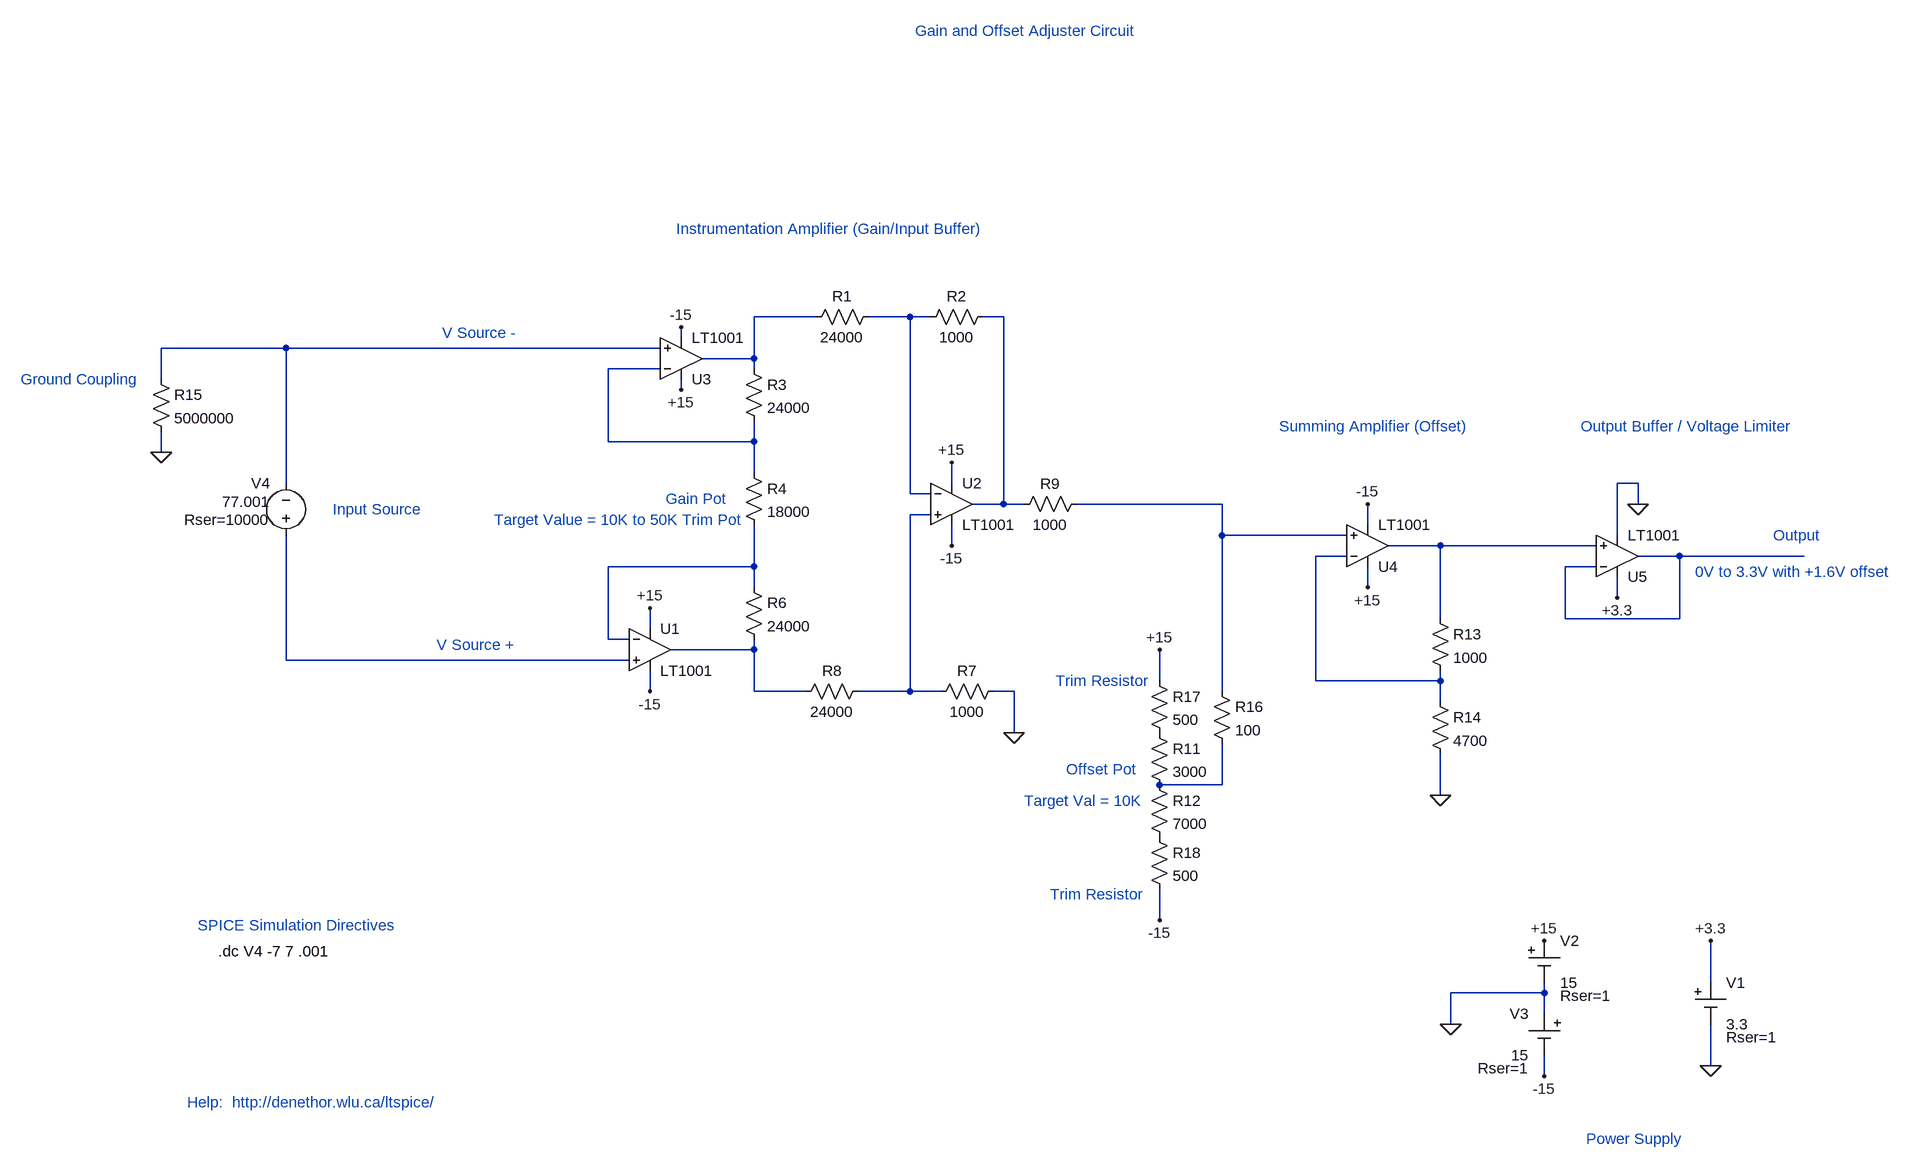
[diagram p0: schematic AnalogScaler_SimulationLTSPICE.asc]
AnalogScaler_SimulationLTSPICE.asc, the LTspice schematic file:
Version 4
SHEET 1 1356 1016
WIRE -384 -352 -480 -352
WIRE -240 -352 -304 -352
WIRE -208 -352 -240 -352
WIRE -96 -352 -128 -352
WIRE -592 -320 -592 -336
WIRE -1200 -304 -1392 -304
WIRE -624 -304 -1200 -304
WIRE -480 -288 -480 -352
WIRE -480 -288 -560 -288
WIRE -624 -272 -704 -272
WIRE -480 -272 -480 -288
WIRE -1392 -256 -1392 -304
WIRE -592 -240 -592 -256
WIRE -704 -160 -704 -272
WIRE -480 -160 -480 -192
WIRE -480 -160 -704 -160
WIRE -1392 -144 -1392 -176
WIRE -480 -112 -480 -160
WIRE -1200 -96 -1200 -304
WIRE -176 -96 -176 -128
WIRE 880 -96 848 -96
WIRE -240 -80 -240 -352
WIRE -208 -80 -240 -80
WIRE -96 -64 -96 -352
WIRE -96 -64 -144 -64
WIRE -64 -64 -96 -64
WIRE 240 -64 16 -64
WIRE 880 -64 880 -96
WIRE -208 -48 -240 -48
WIRE 464 -32 464 -64
WIRE 240 -16 240 -64
WIRE 432 -16 240 -16
WIRE 848 -16 848 -96
WIRE -176 0 -176 -32
WIRE 576 0 496 0
WIRE 816 0 576 0
WIRE 432 16 384 16
WIRE 944 16 880 16
WIRE 1136 16 944 16
WIRE -480 32 -480 -32
WIRE -480 32 -704 32
WIRE 816 32 768 32
WIRE -480 64 -480 32
WIRE 464 64 464 32
WIRE 848 80 848 48
WIRE 576 112 576 0
WIRE 768 112 768 32
WIRE 944 112 944 16
WIRE 944 112 768 112
WIRE -640 128 -640 96
WIRE -704 144 -704 32
WIRE -672 144 -704 144
WIRE -480 160 -480 144
WIRE -480 160 -608 160
WIRE -1200 176 -1200 -16
WIRE -672 176 -1200 176
WIRE 144 208 144 160
WIRE 384 208 384 16
WIRE 576 208 576 192
WIRE 576 208 384 208
WIRE -640 224 -640 192
WIRE -480 224 -480 160
WIRE -400 224 -480 224
WIRE -240 224 -240 -48
WIRE -240 224 -320 224
WIRE -192 224 -240 224
WIRE -80 224 -112 224
WIRE 240 224 240 -16
WIRE 576 240 576 208
WIRE -80 288 -80 224
WIRE 240 368 240 304
WIRE 240 368 144 368
WIRE 576 384 576 320
WIRE 144 576 144 528
WIRE 992 672 992 608
WIRE 736 688 736 672
WIRE 736 688 592 688
WIRE 736 720 736 688
WIRE 592 736 592 688
WIRE 992 800 992 736
WIRE 736 816 736 784
FLAG 736 608 +15
FLAG 736 816 -15
FLAG 992 608 +3.3
FLAG 992 800 0
FLAG 592 736 0
FLAG -592 -240 +15
FLAG -592 -336 -15
FLAG -640 224 -15
FLAG -640 96 +15
FLAG -176 0 -15
FLAG 464 -64 -15
FLAG -176 -128 +15
FLAG 464 64 +15
FLAG 880 -64 0
FLAG 848 80 +3.3
FLAG -80 288 0
FLAG 144 160 +15
FLAG 144 576 -15
FLAG 576 384 0
FLAG -1392 -144 0
SYMBOL Opamps\\LT1001 -640 96 R0
SYMATTR InstName U1
SYMBOL Opamps\\LT1001 -176 -128 R0
SYMATTR InstName U2
SYMBOL Opamps\\LT1001 -592 -224 M180
SYMATTR InstName U3
SYMBOL Opamps\\LT1001 464 64 M180
SYMATTR InstName U4
SYMBOL Opamps\\LT1001 848 80 M180
SYMATTR InstName U5
SYMBOL Misc\\cell 992 672 R0
WINDOW 123 0 0 Left 2
WINDOW 39 24 84 Left 2
SYMATTR SpiceLine Rser=1
SYMATTR InstName V1
SYMATTR Value 3.3
SYMBOL Misc\\cell 736 608 R0
WINDOW 123 0 0 Left 2
WINDOW 39 24 84 Left 2
SYMATTR SpiceLine Rser=1
SYMATTR InstName V2
SYMATTR Value 15
SYMBOL Misc\\cell 736 720 M0
WINDOW 123 0 0 Left 2
WINDOW 39 24 84 Left 2
SYMATTR SpiceLine Rser=1
SYMATTR InstName V3
SYMATTR Value 15
SYMBOL res -288 -368 R90
WINDOW 0 0 56 VBottom 2
WINDOW 3 32 56 VTop 2
SYMATTR InstName R1
SYMATTR Value 24000
SYMBOL res -112 -368 R90
WINDOW 0 0 56 VBottom 2
WINDOW 3 32 56 VTop 2
SYMATTR InstName R2
SYMATTR Value 1000
SYMBOL res -496 -128 R0
SYMATTR InstName R4
SYMATTR Value 18000
SYMBOL res -496 48 R0
SYMATTR InstName R6
SYMATTR Value 24000
SYMBOL res -496 -288 R0
SYMATTR InstName R3
SYMATTR Value 24000
SYMBOL res -304 208 R90
WINDOW 0 0 56 VBottom 2
WINDOW 3 32 56 VTop 2
SYMATTR InstName R8
SYMATTR Value 24000
SYMBOL voltage -1200 0 R180
WINDOW 0 24 96 Left 2
WINDOW 3 24 68 Left 2
WINDOW 39 24 40 Left 2
WINDOW 123 0 0 Left 2
SYMATTR InstName V4
SYMATTR Value 77.001
SYMATTR SpiceLine Rser=10000
SYMBOL res -96 208 R90
WINDOW 0 0 56 VBottom 2
WINDOW 3 32 56 VTop 2
SYMATTR InstName R7
SYMATTR Value 1000
SYMBOL res 32 -80 R90
WINDOW 0 0 56 VBottom 2
WINDOW 3 32 56 VTop 2
SYMATTR InstName R9
SYMATTR Value 1000
SYMBOL res 128 272 R0
SYMATTR InstName R11
SYMATTR Value 3000
SYMBOL res 128 352 R0
SYMATTR InstName R12
SYMATTR Value 7000
SYMBOL res 560 96 R0
SYMATTR InstName R13
SYMATTR Value 1000
SYMBOL res 560 224 R0
SYMATTR InstName R14
SYMATTR Value 4700
SYMBOL res -1408 -272 R0
SYMATTR InstName R15
SYMATTR Value 5000000
SYMBOL res 224 208 R0
SYMATTR InstName R16
SYMATTR Value 100
SYMBOL res 128 192 R0
SYMATTR InstName R17
SYMATTR Value 500
SYMBOL res 128 432 R0
SYMATTR InstName R18
SYMATTR Value 500
TEXT -1128 -56 Left 2 ;Input Source
TEXT 800 912 Left 2 ;Power Supply
TEXT -616 -72 Left 2 ;Gain Pot
TEXT 1088 -16 Left 2 ;Output
TEXT -1352 856 Left 2 ;Help:  http://denethor.wlu.ca/ltspice/
TEXT -1336 584 Left 2 ;SPICE Simulation Directives
TEXT 0 344 Left 2 ;Offset Pot
TEXT -1608 -256 Left 2 ;Ground Coupling
TEXT -960 -328 Left 2 ;V Source -
TEXT -968 152 Left 2 ;V Source +
TEXT -64 392 Left 2 ;Target Val = 10K
TEXT -1304 624 Left 2 !.dc V4 -7 7 .001
TEXT -880 -40 Left 2 ;Target Value = 10K to 50K Trim Pot
TEXT 968 40 Left 2 ;0V to 3.3V with +1.6V offset
TEXT -232 -792 Left 2 ;Gain and Offset Adjuster Circuit
TEXT 792 -184 Left 2 ;Output Buffer / Voltage Limiter
TEXT 328 -184 Left 2 ;Summing Amplifier (Offset)
TEXT -600 -488 Left 2 ;Instrumentation Amplifier (Gain/Input Buffer)
TEXT -16 208 Left 2 ;Trim Resistor
TEXT -24 536 Left 2 ;Trim Resistor

The netlist it stands for:
* AnalogScaler_SimulationLTSPICE.asc
XU1 N013 N011 +15 -15 N012 LT1001  ; pins In+ In- V+ V- OUT
XU2 N007 N002 +15 -15 N003 LT1001  ; pins In+ In- V+ V- OUT
XU3 N004 N005 +15 -15 N001 LT1001  ; pins In+ In- V+ V- OUT
XU4 N006 N009 +15 -15 N008 LT1001  ; pins In+ In- V+ V- OUT
XU5 N008 N010 +3.3 0 N010 LT1001  ; pins In+ In- V+ V- OUT
V1 +3.3 0 3.3 Rser=1
V2 +15 0 15 Rser=1
V3 0 -15 15 Rser=1
R1 N002 N001 24000
R2 N003 N002 1000
R4 N005 N011 18000
R6 N011 N012 24000
R3 N001 N005 24000
R8 N007 N012 24000
V4 N013 N004 77.001 Rser=10000
R7 0 N007 1000
R9 N006 N003 1000
R11 P001 N014 3000
R12 N014 P002 7000
R13 N008 N009 1000
R14 N009 0 4700
R15 N004 0 5000000
R16 N006 N014 100
R17 +15 P001 500
R18 P002 -15 500
* Input Source
* Power Supply
* Gain Pot
* Output
* Help:  http://denethor.wlu.ca/ltspice/
* SPICE Simulation Directives
* Offset Pot
* Ground Coupling
* V Source -
* V Source +
* Target Val = 10K
.dc V4 -7 7 .001
* Target Value = 10K to 50K Trim Pot
* 0V to 3.3V with +1.6V offset
* Gain and Offset Adjuster Circuit
* Output Buffer / Voltage Limiter
* Summing Amplifier (Offset)
* Instrumentation Amplifier (Gain/Input Buffer)
* Trim Resistor
* Trim Resistor
.lib LTC.lib
.backanno
.end